# Altium schematic sheet 0_Architecture.SchDoc
size A4; Organization: SpaceLab UFSC; Address1: UFSC - SpaceLab; Address2: University Campus - Trindade; Address3: Dep. of Electrical Engineering - CTC; Address4: Florianópolis, Santa Catarina, Brazil; Address5: CEP: 88040 - 900
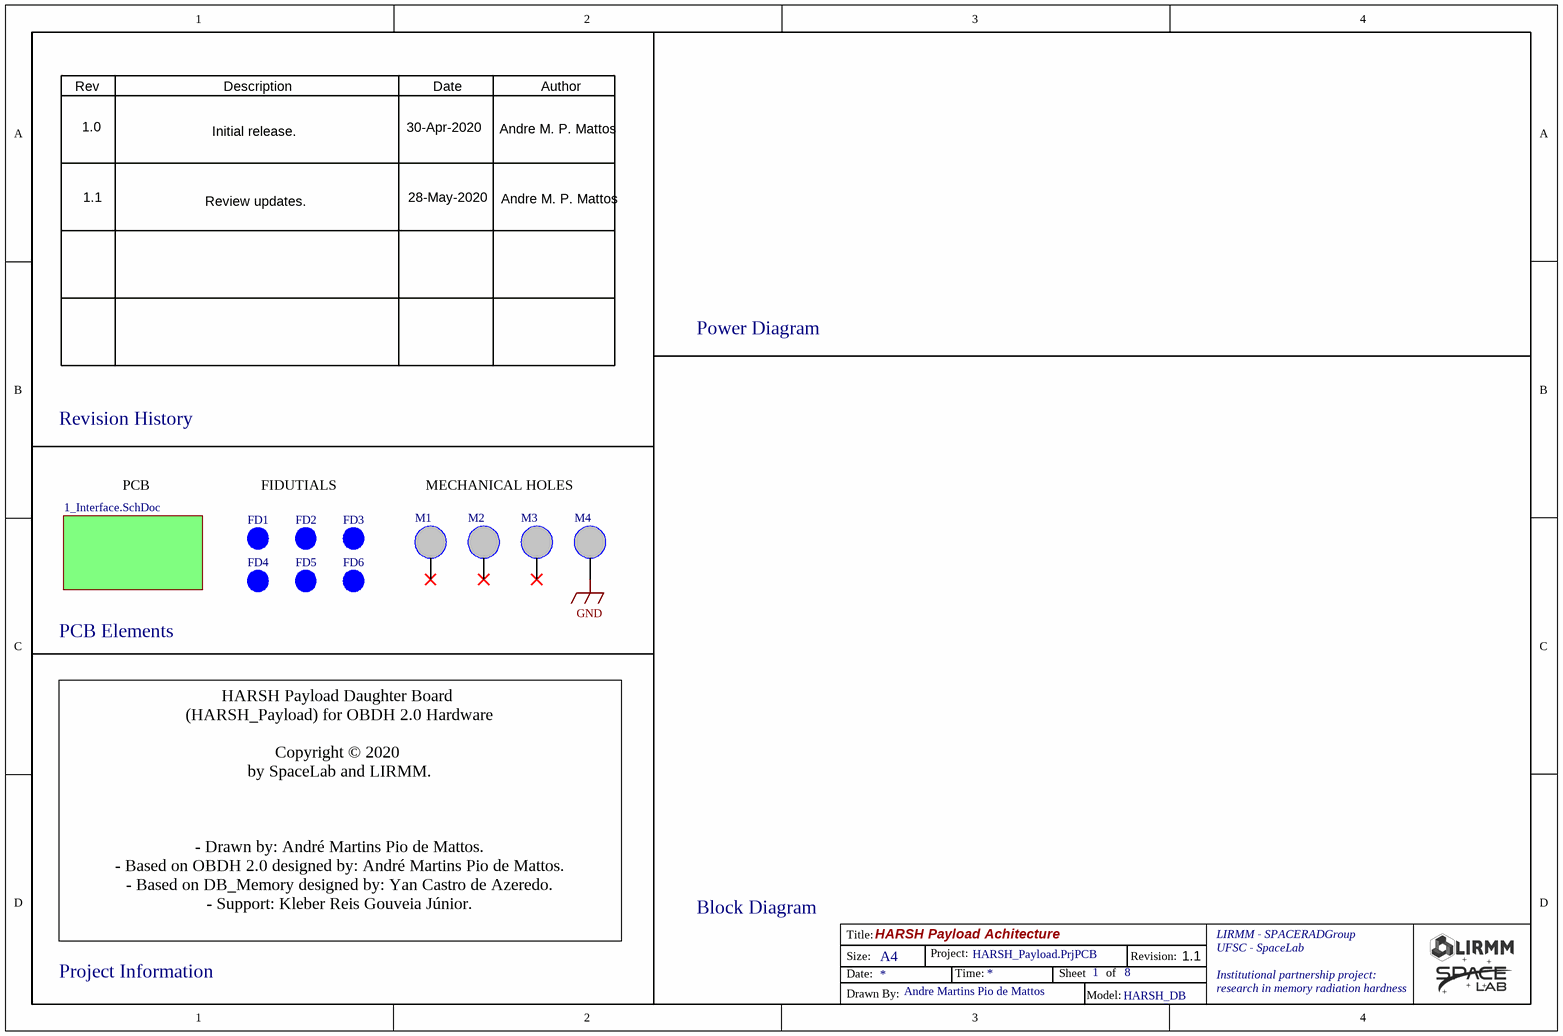
[diagram p0: 0_Architecture.SchDoc]

## Parts
FD1  DONE_FIDUCIAL  [DONE_FIDUCIAL]  (value not drawn)
FD2  DONE_FIDUCIAL  [DONE_FIDUCIAL]  (value not drawn)
FD3  DONE_FIDUCIAL  [DONE_FIDUCIAL]  (value not drawn)
FD4  DONE_FIDUCIAL  [DONE_FIDUCIAL]  (value not drawn)
FD5  DONE_FIDUCIAL  [DONE_FIDUCIAL]  (value not drawn)
FD6  DONE_FIDUCIAL  [DONE_FIDUCIAL]  (value not drawn)
M1  DONE_MOUNT_HOLE  [DONE_M3_MOUNT_HOLE]  (value not drawn)
M2  DONE_MOUNT_HOLE  [DONE_M3_MOUNT_HOLE]  (value not drawn)
M3  DONE_MOUNT_HOLE  [DONE_M3_MOUNT_HOLE]  (value not drawn)
M4  DONE_MOUNT_HOLE  [DONE_M3_MOUNT_HOLE]  (value not drawn)

## Sub-sheets
Interface = 1_Interface.SchDoc: no entries

## Nets
GND: M4.0

Not connected (* = marked no-connect by the designer): M1 0*; M2 0*; M3 0*

## Notes on the sheet
- Rev
- Description
- Date
- Author
- 1.0
- Initial release.
- 30-Apr-2020
- Andre M. P. Mattos
- 1.1
- Review updates.
- 28-May-2020
- Power Diagram
- Revision History
- PCB
- FIDUTIALS
- MECHANICAL HOLES
- PCB Elements
- Block Diagram
- HARSH Payload Daughter Board
  (HARSH_Payload) for OBDH 2.0 Hardware
  Copyright © 2020
  by SpaceLab and LIRMM.
  - Drawn by: André Martins Pio de Mattos.
  - Based on OBDH 2.0 designed by: André Martins Pio de Mattos.
  - Based on DB_Memory designed by: Yan Castro de Azeredo.
  - Support: Kleber Reis Gouveia Júnior.
- Project Information
- HARSH Payload Achitecture
- HARSH_Payload.PrjPCB
- 1
- 8
- Andre Martins Pio de Mattos
- HARSH_DB
- Title:
- Size:
- Date:
- A4
- Project:
- Time:
- Sheet
- of
- Revision:
- LIRMM - SPACERADGroup
- UFSC - SpaceLab
- Institutional partnership project:
- research in memory radiation hardness
- Drawn By:
- Model:

## Library data of the parts
FD1-FD6 = DONE_FIDUCIAL: Fiducial for DB board variants
M1-M4 = DONE_MOUNT_HOLE: Mechanical Hole for DB board variants